# Altium schematic sheet RS485.SchDoc
size A3; Date: *******; ApprovedBy: *******; CheckedBy: None; Author: *******; CompanyName: *******; DrawnBy: V.HIEU; Engineer: *******; Organization: *******; Address2: *******; Address3: *******; Address4: *******; DocumentNumber: Doc Num; Revision: V1.0; Email: truongvanhieu17102005@gmail.com; CurrentTime: *******; CurrentDate: *******; Time: *******; DocumentFullPathAndName: *******; DocumentName: *******; ModifiedDate: *******; ImagePath: *******; ProjectName: *******; Application_BuildNumber: *******
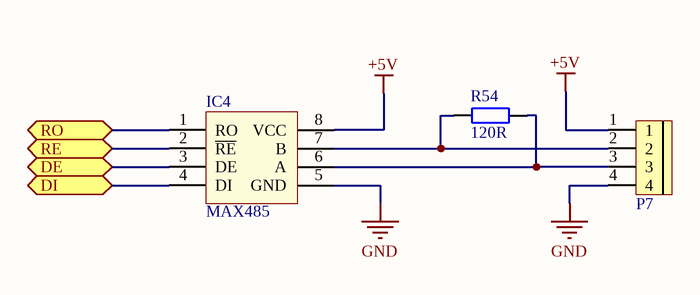
[diagram p0: RS485.SchDoc]

## Parts
IC4  MAX485  [SO-8]
P7  CON 4 EDG5.08  [CON 4 4EDG5.08]  (value not drawn)
R54  120R  [tro smd 0805]

## Ports
DE (bidir), DI (bidir), RE (bidir), RO (bidir)

## Nets
+5V: IC4.8(VCC) P7.1
GND: IC4.5(GND) P7.4
DE: IC4.3(DE) ; port DE
DI: IC4.4(DI) ; port DI
RE: IC4.2(~{RE}) ; port RE
RO: IC4.1(RO) ; port RO
NetIC4_6: IC4.6(A) P7.3 R54.2
NetIC4_7: IC4.7(B) P7.2 R54.1

## Notes on the sheet
- Title:
- Size:
- Drawn By:
- Page Contents:
- A3
- Number:
- Checked By:
- Revision:
- Date:
- File:
- License:
- Email:
- Time:
- Sheet
- Website:
- of

## Library data of the parts
IC4 = MAX485: RS232 - RS485 (Same sn75176)
P7 = CON 4 EDG5.08: Cắm; Ten_Linh_Kien: CON 4 2EDG5.08-4P 5.08MM ( Xanh Cong); Ma_Hang: MH000979; Don_Vi: Con; Ghi_Chu: *; Kieu_Chan: *; Chung_Loai: Cắm
R54 = Tro 0805 5% 120R: Dán; Don_Vi: Con; So_Chan: 2; Ten_Linh_Kien: Trở 0805 5% 120R; Ma_Hang: MH005253; Chung_Loai: Dán; Kieu_Chan: *